# EasyEDA schematic SCH_Trail-PCB_2024-05-27.json

## Sheets
1 Sheet_1
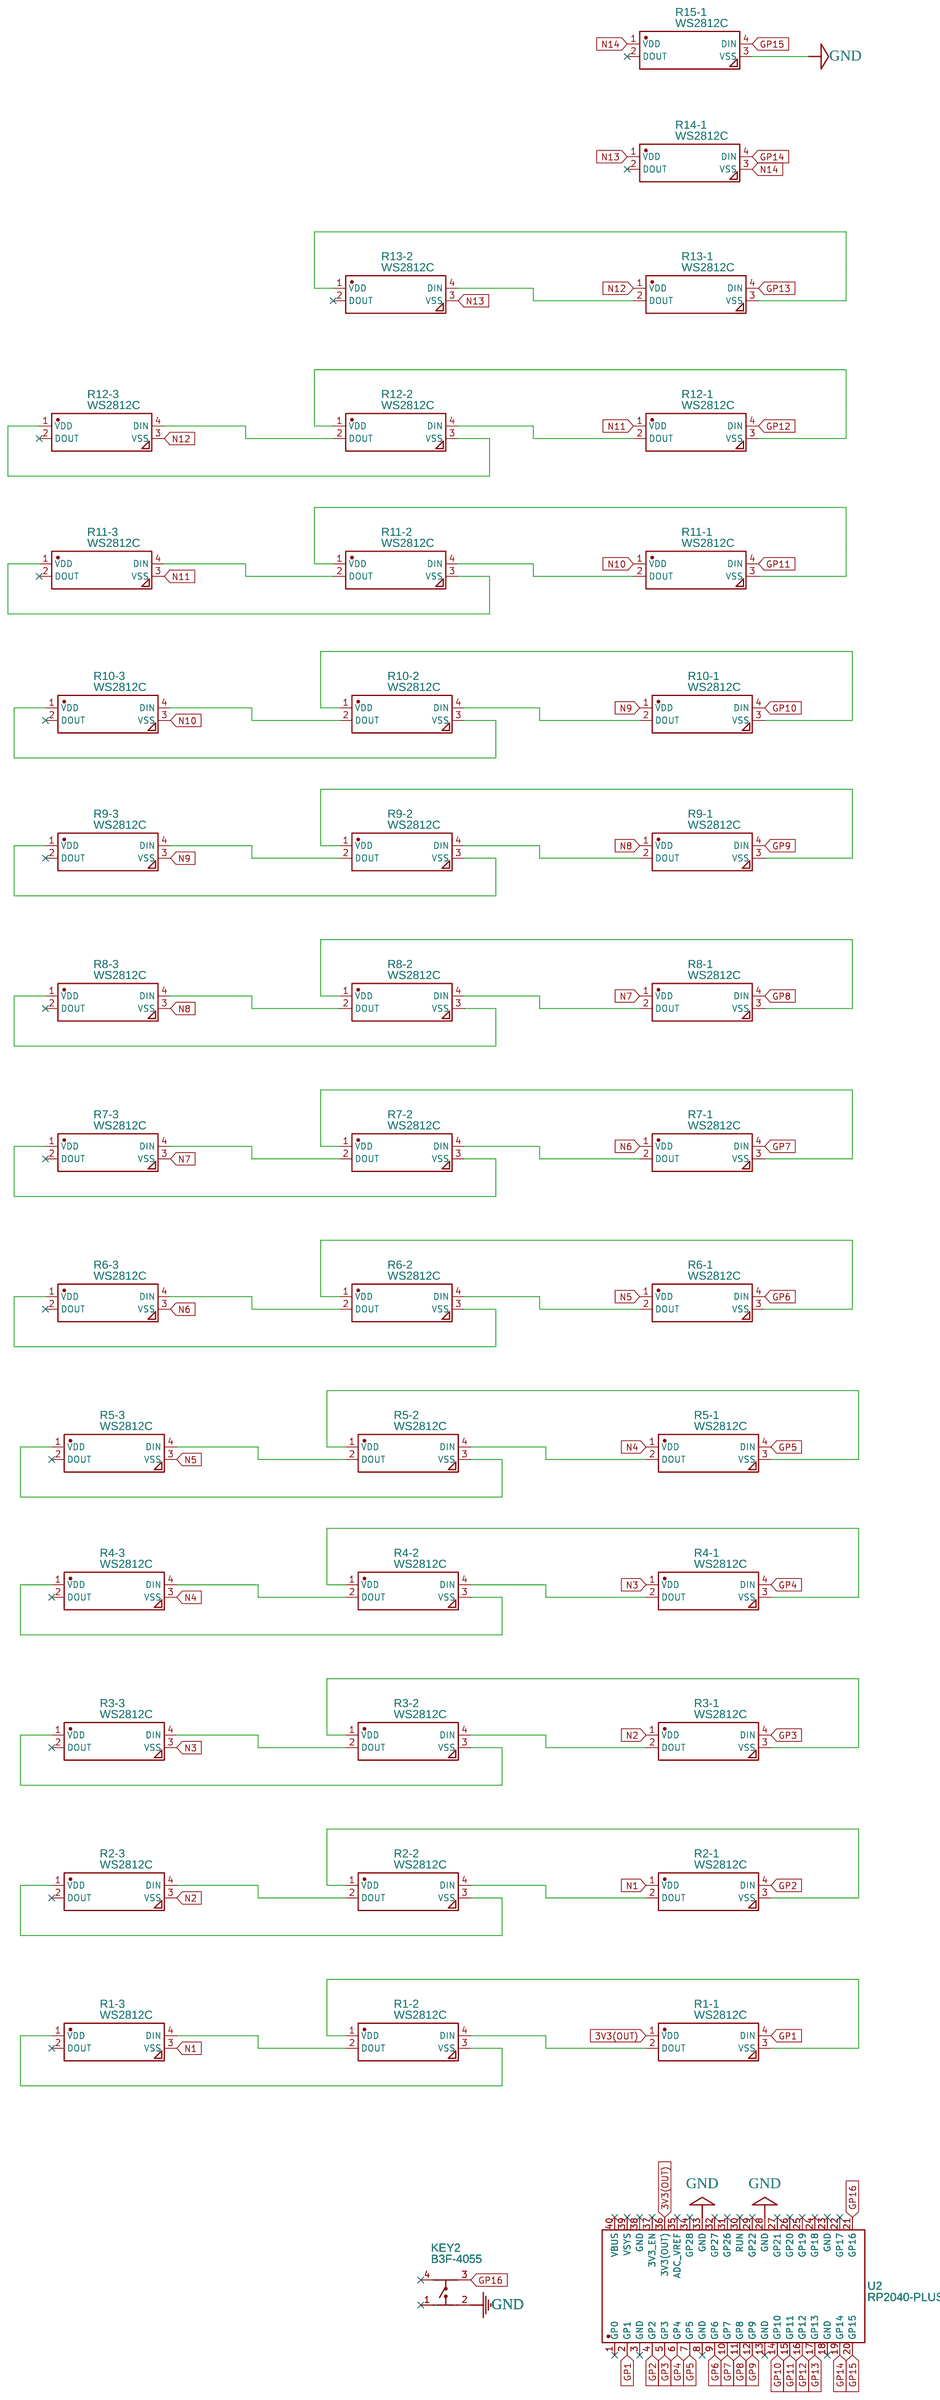
[diagram p0: Sheet_1]
2 Sheet_2: TITLE: Sheet_2; REV: 1.0; Date: 2024-05-25; Sheet: 1/1; Drawn By: sam35; Company: Your Company
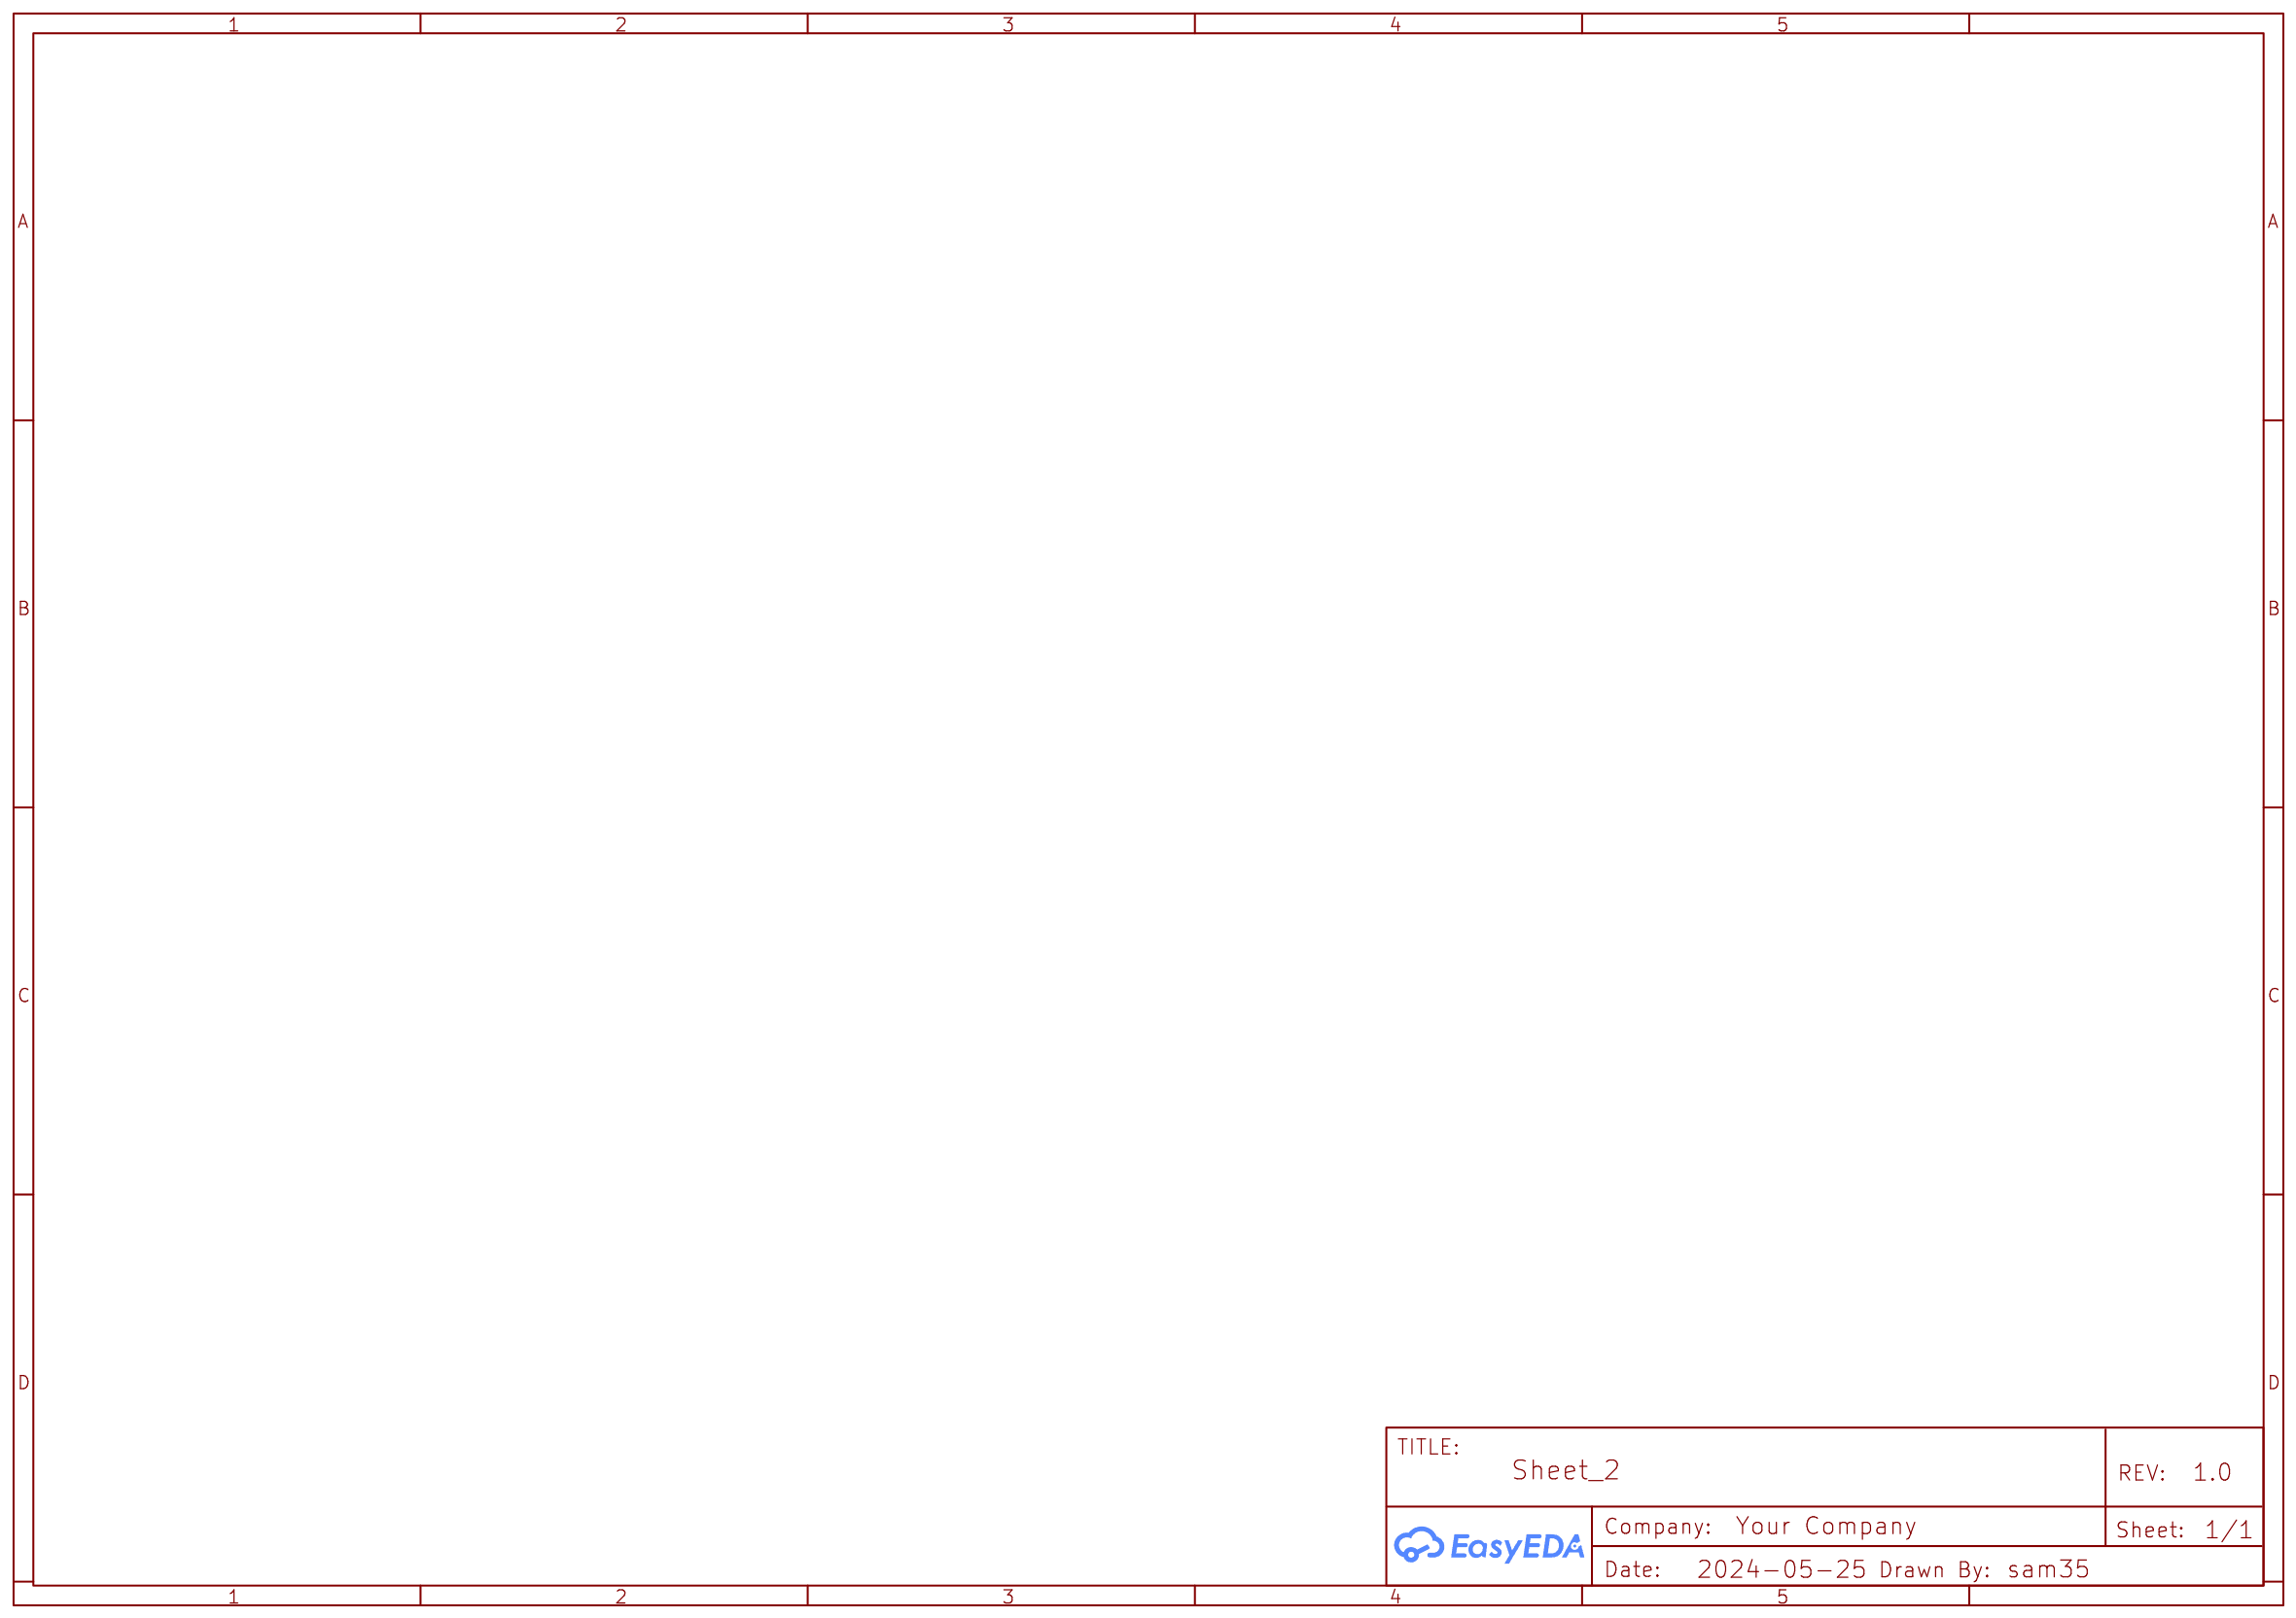
[diagram p1: Sheet_2]

## Parts
KEY2  B3F-4055  [KEY-TH_4P-L12.0-W12.0-P5.00-LS13.4-EH]
R1-1  WS2812C  [LED-SMD_4P-L5.0-W5.0-LS5.4-TL-1]
R1-2  WS2812C  [LED-SMD_4P-L5.0-W5.0-LS5.4-TL-1]
R1-3  WS2812C  [LED-SMD_4P-L5.0-W5.0-LS5.4-TL-1]
R2-1  WS2812C  [LED-SMD_4P-L5.0-W5.0-LS5.4-TL-1]
R2-2  WS2812C  [LED-SMD_4P-L5.0-W5.0-LS5.4-TL-1]
R2-3  WS2812C  [LED-SMD_4P-L5.0-W5.0-LS5.4-TL-1]
R3-1  WS2812C  [LED-SMD_4P-L5.0-W5.0-LS5.4-TL-1]
R3-2  WS2812C  [LED-SMD_4P-L5.0-W5.0-LS5.4-TL-1]
R3-3  WS2812C  [LED-SMD_4P-L5.0-W5.0-LS5.4-TL-1]
R4-1  WS2812C  [LED-SMD_4P-L5.0-W5.0-LS5.4-TL-1]
R4-2  WS2812C  [LED-SMD_4P-L5.0-W5.0-LS5.4-TL-1]
R4-3  WS2812C  [LED-SMD_4P-L5.0-W5.0-LS5.4-TL-1]
R5-1  WS2812C  [LED-SMD_4P-L5.0-W5.0-LS5.4-TL-1]
R5-2  WS2812C  [LED-SMD_4P-L5.0-W5.0-LS5.4-TL-1]
R5-3  WS2812C  [LED-SMD_4P-L5.0-W5.0-LS5.4-TL-1]
R6-1  WS2812C  [LED-SMD_4P-L5.0-W5.0-LS5.4-TL-1]
R6-2  WS2812C  [LED-SMD_4P-L5.0-W5.0-LS5.4-TL-1]
R6-3  WS2812C  [LED-SMD_4P-L5.0-W5.0-LS5.4-TL-1]
R7-1  WS2812C  [LED-SMD_4P-L5.0-W5.0-LS5.4-TL-1]
R7-2  WS2812C  [LED-SMD_4P-L5.0-W5.0-LS5.4-TL-1]
R7-3  WS2812C  [LED-SMD_4P-L5.0-W5.0-LS5.4-TL-1]
R8-1  WS2812C  [LED-SMD_4P-L5.0-W5.0-LS5.4-TL-1]
R8-2  WS2812C  [LED-SMD_4P-L5.0-W5.0-LS5.4-TL-1]
R8-3  WS2812C  [LED-SMD_4P-L5.0-W5.0-LS5.4-TL-1]
R9-1  WS2812C  [LED-SMD_4P-L5.0-W5.0-LS5.4-TL-1]
R9-2  WS2812C  [LED-SMD_4P-L5.0-W5.0-LS5.4-TL-1]
R9-3  WS2812C  [LED-SMD_4P-L5.0-W5.0-LS5.4-TL-1]
R10-1  WS2812C  [LED-SMD_4P-L5.0-W5.0-LS5.4-TL-1]
R10-2  WS2812C  [LED-SMD_4P-L5.0-W5.0-LS5.4-TL-1]
R10-3  WS2812C  [LED-SMD_4P-L5.0-W5.0-LS5.4-TL-1]
R11-1  WS2812C  [LED-SMD_4P-L5.0-W5.0-LS5.4-TL-1]
R11-2  WS2812C  [LED-SMD_4P-L5.0-W5.0-LS5.4-TL-1]
R11-3  WS2812C  [LED-SMD_4P-L5.0-W5.0-LS5.4-TL-1]
R12-1  WS2812C  [LED-SMD_4P-L5.0-W5.0-LS5.4-TL-1]
R12-2  WS2812C  [LED-SMD_4P-L5.0-W5.0-LS5.4-TL-1]
R12-3  WS2812C  [LED-SMD_4P-L5.0-W5.0-LS5.4-TL-1]
R13-1  WS2812C  [LED-SMD_4P-L5.0-W5.0-LS5.4-TL-1]
R13-2  WS2812C  [LED-SMD_4P-L5.0-W5.0-LS5.4-TL-1]
R14-1  WS2812C  [LED-SMD_4P-L5.0-W5.0-LS5.4-TL-1]
R15-1  WS2812C  [LED-SMD_4P-L5.0-W5.0-LS5.4-TL-1]
U2  RP2040-PLUS  [LCC-40_L51.0-W21.0-P2.54-BL_RP2040-BASED]

## Library data of the parts
KEY2 = B3F-4055: Supplier: LCSC; Manufacturer: OMRON(欧姆龙); Supplier Part: C84931; JLCPCB Part Class: Extended Part
R1-1-R1-3 R2-1-R2-3 R3-1-R3-3 R4-1-R4-3 R5-1-R5-3 R6-1-R6-3 R7-1-R7-3 R8-1-R8-3 R9-1-R9-3 R10-1-R10-3 R11-1-R11-3 R12-1-R12-3 R13-1 R13-2 R14-1 R15-1 = WS2812C: Contributor: LCSC; Supplier: LCSC; Manufacturer: worldsemi; Supplier Part: C114587; JLCPCB Part Class: Extended Part
U2 = RP2040-PLUS: Supplier: LCSC; Supplier Part: C5374681; Manufacturer: Waveshare(微雪电子); Manufacturer Part: RP2040-Plus; JLCPCB Part Class: Extended Part

## Nets
3V3(OUT): R1-1.1(VDD) U2.36(3V3(OUT))
GND: KEY2.2 R15-1.3(VSS) U2.28(GND) U2.33(GND)
GP1: R1-1.4(DIN) U2.2(GP1)
GP2: R2-1.4(DIN) U2.4(GP2)
GP3: R3-1.4(DIN) U2.5(GP3)
GP4: R4-1.4(DIN) U2.6(GP4)
GP5: R5-1.4(DIN) U2.7(GP5)
GP6: R6-1.4(DIN) U2.9(GP6)
GP7: R7-1.4(DIN) U2.10(GP7)
GP8: R8-1.4(DIN) U2.11(GP8)
GP9: R9-1.4(DIN) U2.12(GP9)
GP10: R10-1.4(DIN) U2.14(GP10)
GP11: R11-1.4(DIN) U2.15(GP11)
GP12: R12-1.4(DIN) U2.16(GP12)
GP13: R13-1.4(DIN) U2.17(GP13)
GP14: R14-1.4(DIN) U2.19(GP14)
GP15: R15-1.4(DIN) U2.20(GP15)
GP16: KEY2.3 U2.21(GP16)
N1: R1-3.3(VSS) R2-1.1(VDD)
N2: R2-3.3(VSS) R3-1.1(VDD)
N3: R3-3.3(VSS) R4-1.1(VDD)
N4: R4-3.3(VSS) R5-1.1(VDD)
N5: R5-3.3(VSS) R6-1.1(VDD)
N6: R6-3.3(VSS) R7-1.1(VDD)
N7: R7-3.3(VSS) R8-1.1(VDD)
N8: R8-3.3(VSS) R9-1.1(VDD)
N9: R9-3.3(VSS) R10-1.1(VDD)
N10: R10-3.3(VSS) R11-1.1(VDD)
N11: R11-3.3(VSS) R12-1.1(VDD)
N12: R12-3.3(VSS) R13-1.1(VDD)
N13: R13-2.3(VSS) R14-1.1(VDD)
N14: R14-1.3(VSS) R15-1.1(VDD)
Net-(R1-1-2): R1-1.2(DOUT) R1-2.4(DIN)
Net-(R1-1-3): R1-1.3(VSS) R1-2.1(VDD)
Net-(R1-2-2): R1-2.2(DOUT) R1-3.4(DIN)
Net-(R1-2-3): R1-2.3(VSS) R1-3.1(VDD)
Net-(R2-1-2): R2-1.2(DOUT) R2-2.4(DIN)
Net-(R2-1-3): R2-1.3(VSS) R2-2.1(VDD)
Net-(R2-2-2): R2-2.2(DOUT) R2-3.4(DIN)
Net-(R2-2-3): R2-2.3(VSS) R2-3.1(VDD)
Net-(R3-1-2): R3-1.2(DOUT) R3-2.4(DIN)
Net-(R3-1-3): R3-1.3(VSS) R3-2.1(VDD)
Net-(R3-2-2): R3-2.2(DOUT) R3-3.4(DIN)
Net-(R3-2-3): R3-2.3(VSS) R3-3.1(VDD)
Net-(R4-1-2): R4-1.2(DOUT) R4-2.4(DIN)
Net-(R4-1-3): R4-1.3(VSS) R4-2.1(VDD)
Net-(R4-2-2): R4-2.2(DOUT) R4-3.4(DIN)
Net-(R4-2-3): R4-2.3(VSS) R4-3.1(VDD)
Net-(R5-1-2): R5-1.2(DOUT) R5-2.4(DIN)
Net-(R5-1-3): R5-1.3(VSS) R5-2.1(VDD)
Net-(R5-2-2): R5-2.2(DOUT) R5-3.4(DIN)
Net-(R5-2-3): R5-2.3(VSS) R5-3.1(VDD)
Net-(R6-1-2): R6-1.2(DOUT) R6-2.4(DIN)
Net-(R6-1-3): R6-1.3(VSS) R6-2.1(VDD)
Net-(R6-2-2): R6-2.2(DOUT) R6-3.4(DIN)
Net-(R6-2-3): R6-2.3(VSS) R6-3.1(VDD)
Net-(R7-1-2): R7-1.2(DOUT) R7-2.4(DIN)
Net-(R7-1-3): R7-1.3(VSS) R7-2.1(VDD)
Net-(R7-2-2): R7-2.2(DOUT) R7-3.4(DIN)
Net-(R7-2-3): R7-2.3(VSS) R7-3.1(VDD)
Net-(R8-1-2): R8-1.2(DOUT) R8-2.4(DIN)
Net-(R8-1-3): R8-1.3(VSS) R8-2.1(VDD)
Net-(R8-2-2): R8-2.2(DOUT) R8-3.4(DIN)
Net-(R8-2-3): R8-2.3(VSS) R8-3.1(VDD)
Net-(R9-1-2): R9-1.2(DOUT) R9-2.4(DIN)
Net-(R9-1-3): R9-1.3(VSS) R9-2.1(VDD)
Net-(R9-2-2): R9-2.2(DOUT) R9-3.4(DIN)
Net-(R9-2-3): R9-2.3(VSS) R9-3.1(VDD)
Net-(R10-1-2): R10-1.2(DOUT) R10-2.4(DIN)
Net-(R10-1-3): R10-1.3(VSS) R10-2.1(VDD)
Net-(R10-2-2): R10-2.2(DOUT) R10-3.4(DIN)
Net-(R10-2-3): R10-2.3(VSS) R10-3.1(VDD)
Net-(R11-1-2): R11-1.2(DOUT) R11-2.4(DIN)
Net-(R11-1-3): R11-1.3(VSS) R11-2.1(VDD)
Net-(R11-2-2): R11-2.2(DOUT) R11-3.4(DIN)
Net-(R11-2-3): R11-2.3(VSS) R11-3.1(VDD)
Net-(R12-1-2): R12-1.2(DOUT) R12-2.4(DIN)
Net-(R12-1-3): R12-1.3(VSS) R12-2.1(VDD)
Net-(R12-2-2): R12-2.2(DOUT) R12-3.4(DIN)
Net-(R12-2-3): R12-2.3(VSS) R12-3.1(VDD)
Net-(R13-1-2): R13-1.2(DOUT) R13-2.4(DIN)
Net-(R13-1-3): R13-1.3(VSS) R13-2.1(VDD)

Not connected (* = marked no-connect by the designer): KEY2 1* 4*; R1-3 2(DOUT)*; R2-3 2(DOUT)*; R3-3 2(DOUT)*; R4-3 2(DOUT)*; R5-3 2(DOUT)*; R6-3 2(DOUT)*; R7-3 2(DOUT)*; R8-3 2(DOUT)*; R9-3 2(DOUT)*; R10-3 2(DOUT)*; R11-3 2(DOUT)*; R12-3 2(DOUT)*; R13-2 2(DOUT)*; R14-1 2(DOUT)*; R15-1 2(DOUT)*; U2 1(GP0)* 3(GND)* 8(GND)* 13(GND)* 18(GND)* 22(GP17)* 23(GND)* 24(GP18)* 25(GP19)* 26(GP20)* 27(GP21)* 29(GP22)* 30(RUN)* 31(GP26)* 32(GP27)* 34(GP28)* 35(ADC_VREF)* 37(3V3_EN)* 38(GND)* 39(VSYS)* 40(VBUS)*
